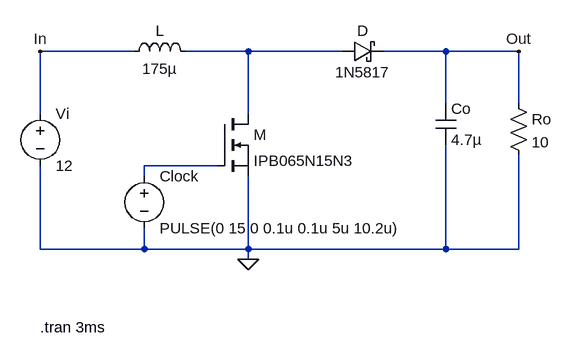
[diagram p0: schematic Boost Converter.asc]
Boost Converter.asc, the LTspice schematic file:
Version 4.1
SHEET 1 880 680
WIRE -240 -64 -384 -64
WIRE -64 -64 -160 -64
WIRE 80 -64 -64 -64
WIRE 240 -64 144 -64
WIRE 352 -64 240 -64
WIRE 240 16 240 -64
WIRE 352 16 352 -64
WIRE -384 32 -384 -64
WIRE -64 32 -64 -64
WIRE -112 112 -224 112
WIRE -224 128 -224 112
WIRE -384 240 -384 112
WIRE -224 240 -224 208
WIRE -224 240 -384 240
WIRE -64 240 -64 128
WIRE -64 240 -224 240
WIRE 240 240 240 80
WIRE 240 240 -64 240
WIRE 352 240 352 96
WIRE 352 240 240 240
WIRE -64 256 -64 240
FLAG -64 256 0
FLAG 352 -64 Out
FLAG -384 -64 In
SYMBOL nmos -112 32 R0
SYMATTR InstName M
SYMATTR Value IPB065N15N3
SYMBOL ind -256 -48 R270
WINDOW 0 32 56 VTop 2
WINDOW 3 5 56 VBottom 2
SYMATTR InstName L
SYMATTR Value 175µ
SYMBOL schottky 80 -48 R270
WINDOW 0 32 32 VTop 2
WINDOW 3 0 32 VBottom 2
SYMATTR InstName D
SYMATTR Value 1N5817
SYMATTR Description Diode
SYMATTR Type diode
SYMBOL cap 224 16 R0
SYMATTR InstName Co
SYMATTR Value 4.7µ
SYMBOL res 336 0 R0
SYMATTR InstName Ro
SYMATTR Value 10
SYMBOL voltage -224 112 R0
WINDOW 123 0 0 Left 2
WINDOW 39 0 0 Left 2
SYMATTR InstName Clock
SYMATTR Value PULSE(0 15 0 0.1u 0.1u 5u 10.2u)
SYMBOL voltage -384 16 R0
WINDOW 123 0 0 Left 2
WINDOW 39 0 0 Left 2
SYMATTR InstName Vi
SYMATTR Value 12
TEXT -384 360 Left 2 !.tran 3ms

The netlist it stands for:
* Boost Converter.asc
M N001 N002 0 0 IPB065N15N3
L In N001 175µ
D N001 Out 1N5817
Co Out 0 4.7µ
Ro Out 0 10
V§Clock N002 0 PULSE(0 15 0 0.1u 0.1u 5u 10.2u)
Vi In 0 12
.model D D
.lib standard.dio
.model NMOS NMOS
.model PMOS PMOS
.lib standard.mos
.tran 3ms
.backanno
.end